# Altium schematic sheet 425AK01A_S09.SchDoc
size A3; DocumentNumber: 9; SheetNumber: 9; SheetTotal: 10; PageSetup: Record=PageOptions|CenterHorizontal=True|CenterVertical=True|PrintScale=1.01|XCorrection=1.00|YCorrection=1.00|PrintKind=1|BorderSize=5000000|LeftOffset=0|BottomOffset=0|Orientation=2|PaperLength=1000|PaperWidth=1000|Scale=100|PaperSource=15|PrintQuality=600|MediaType=1|DitherType=10|PaperKind=A3|PrintScaleMode=1; 00_Drawn: RJG; 00_Date: 8APR2022; 00_Checked: SR; 00_Approved: GN; 00_Line1: Switches and Output Buffers
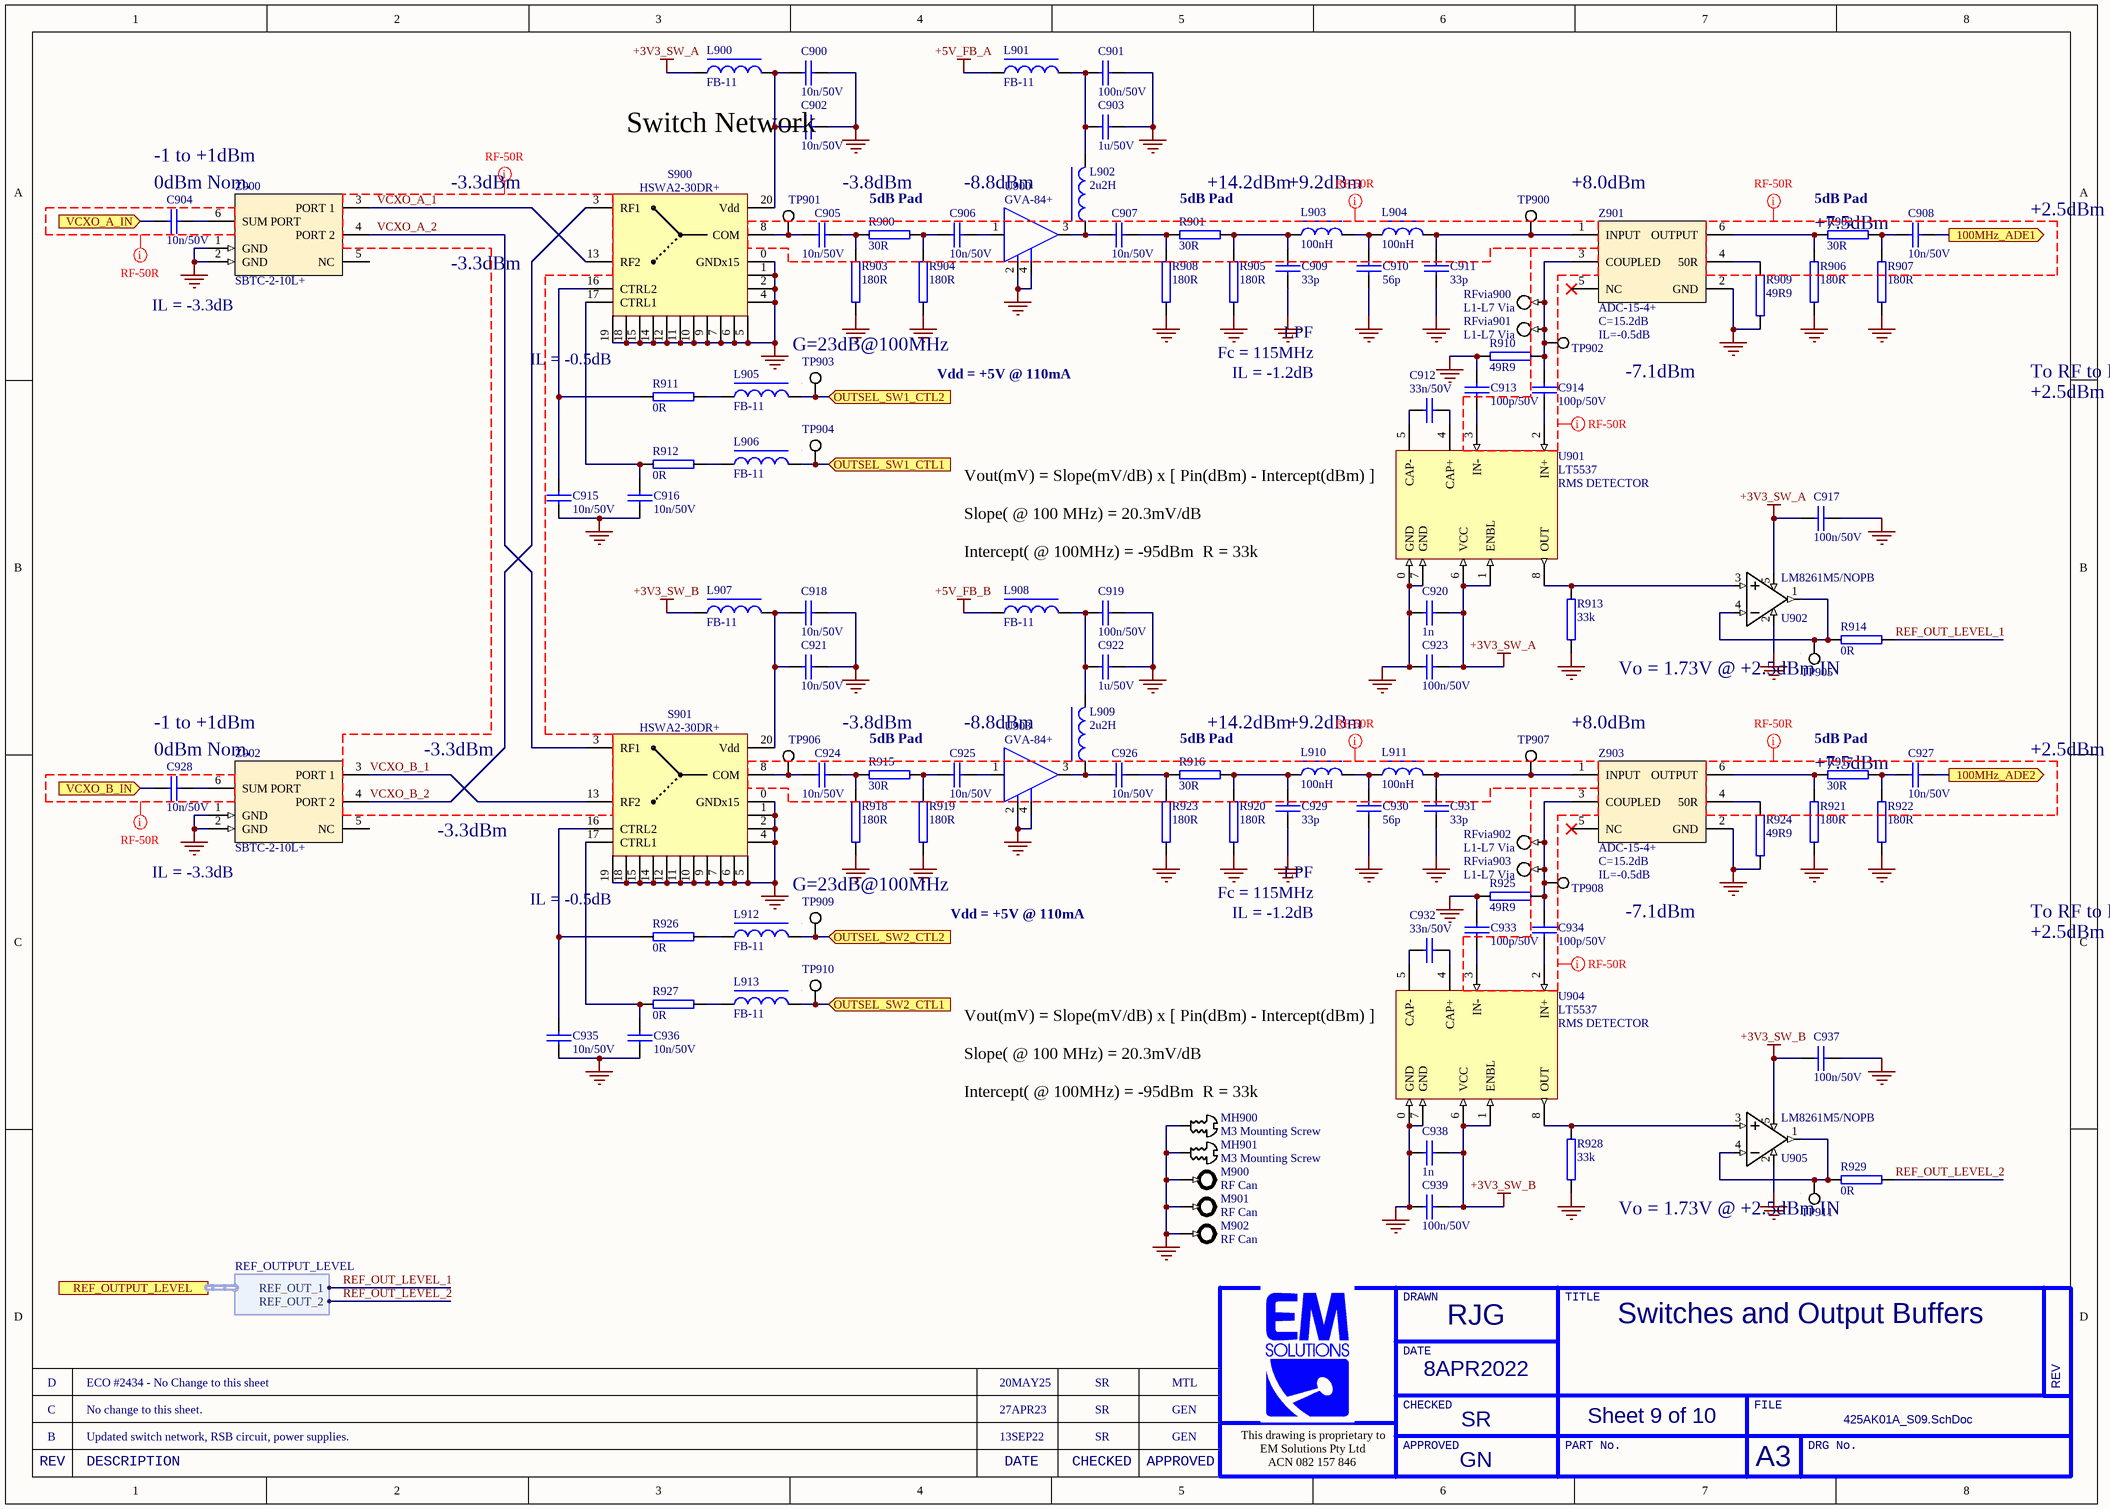
[diagram p0: 425AK01A_S09.SchDoc]

## Parts
C900  10n/50V  [0402C]
C901  100n/50V  [0402C]
C902  10n/50V  [0402C]
C903  1u/50V  [0603C]
C904  10n/50V  [0402C]
C905  10n/50V  [0402C]
C906  10n/50V  [0402C]
C907  10n/50V  [0402C]
C908  10n/50V  [0402C]
C909  33p  [0402C]
C910  56p  [0402C]
C911  33p  [0402C]
C912  33n/50V  [0402C]
C913  100p/50V  [0402C]
C914  100p/50V  [0402C]
C915  10n/50V  [0402C]
C916  10n/50V  [0402C]
C917  100n/50V  [0402C]
C918  10n/50V  [0402C]
C919  100n/50V  [0402C]
C920  1n  [0402C]
C921  10n/50V  [0402C]
C922  1u/50V  [0603C]
C923  100n/50V  [0402C]
C924  10n/50V  [0402C]
C925  10n/50V  [0402C]
C926  10n/50V  [0402C]
C927  10n/50V  [0402C]
C928  10n/50V  [0402C]
C929  33p  [0402C]
C930  56p  [0402C]
C931  33p  [0402C]
C932  33n/50V  [0402C]
C933  100p/50V  [0402C]
C934  100p/50V  [0402C]
C935  10n/50V  [0402C]
C936  10n/50V  [0402C]
C937  100n/50V  [0402C]
C938  1n  [0402C]
C939  100n/50V  [0402C]
L900  FB-11  [0402L]
L901  FB-11  [0402L]
L902  2u2H  [0805L]
L903  100nH  [0402L]
L904  100nH  [0402L]
L905  FB-11  [0402L]
L906  FB-11  [0402L]
L907  FB-11  [0402L]
L908  FB-11  [0402L]
L909  2u2H  [0805L]
L910  100nH  [0402L]
L911  100nH  [0402L]
L912  FB-11  [0402L]
L913  FB-11  [0402L]
M900  RF Can  [Can_38x25.4x6mm]
M901  RF Can  [Can_38x25.4x6mm]
M902  RF Can  [Can_38x25.4x6mm]
MH900  M3 Mounting Screw  [M3_SCREW]  (no BOM)
MH901  M3 Mounting Screw  [M3_SCREW]  (no BOM)
R900  30R  [0402]
R901  30R  [0402]
R902  30R  [0402]
R903  180R  [0402]
R904  180R  [0402]
R905  180R  [0402]
R906  180R  [0402]
R907  180R  [0402]
R908  180R  [0402]
R909  49R9  [0402]
R910  49R9  [0402]
R911  0R  [0402]
R912  0R  [0402]
R913  33k  [0402]
R914  0R  [0402]
R915  30R  [0402]
R916  30R  [0402]
R917  30R  [0402]
R918  180R  [0402]
R919  180R  [0402]
R920  180R  [0402]
R921  180R  [0402]
R922  180R  [0402]
R923  180R  [0402]
R924  49R9  [0402]
R925  49R9  [0402]
R926  0R  [0402]
R927  0R  [0402]
R928  33k  [0402]
R929  0R  [0402]
RFvia900  L1-L7 Via  [RFvia_L1-L7]  (no BOM)
RFvia901  L1-L7 Via  [RFvia_L1-L7]  (no BOM)
RFvia902  L1-L7 Via  [RFvia_L1-L7]  (no BOM)
RFvia903  L1-L7 Via  [RFvia_L1-L7]  (no BOM)
S900  HSWA2-30DR+  [DG983-1]
S901  HSWA2-30DR+  [DG983-1]
TP900  Pad  [Testpoint-0.5mm-SMT-withPaste]  (value not drawn)  (no BOM)
TP901  Pad  [Testpoint-0.5mm-SMT-withPaste]  (value not drawn)  (no BOM)
TP902  Pad  [Testpoint-0.5mm-SMT-withPaste]  (value not drawn)  (no BOM)
TP903  Pad  [Testpoint-0.5mm-SMT-withPaste]  (value not drawn)  (no BOM)
TP904  Pad  [Testpoint-0.5mm-SMT-withPaste]  (value not drawn)  (no BOM)
TP905  Pad  [Testpoint-0.5mm-SMT-withPaste]  (value not drawn)  (no BOM)
TP906  Pad  [Testpoint-0.5mm-SMT-withPaste]  (value not drawn)  (no BOM)
TP907  Pad  [Testpoint-0.5mm-SMT-withPaste]  (value not drawn)  (no BOM)
TP908  Pad  [Testpoint-0.5mm-SMT-withPaste]  (value not drawn)  (no BOM)
TP909  Pad  [Testpoint-0.5mm-SMT-withPaste]  (value not drawn)  (no BOM)
TP910  Pad  [Testpoint-0.5mm-SMT-withPaste]  (value not drawn)  (no BOM)
TP911  Pad  [Testpoint-0.5mm-SMT-withPaste]  (value not drawn)  (no BOM)
U900  GVA-84+  [SOT-89-RF]
U901  LT5537  [DFN-8]
U902  LM8261M5/NOPB  [SOT-23/5]
U903  GVA-84+  [SOT-89-RF]
U904  LT5537  [DFN-8]
U905  LM8261M5/NOPB  [SOT-23/5]
Z900  SBTC-2-10L+  [SBTC-2-10L+]
Z901  ADC-15-4+  [ADC-15-4+]
Z902  SBTC-2-10L+  [SBTC-2-10L+]
Z903  ADC-15-4+  [ADC-15-4+]

## Ports
100MHz_ADE1 (out), 100MHz_ADE2 (out), OUTSEL_SW1_CTL1 (in), OUTSEL_SW1_CTL2 (in), OUTSEL_SW2_CTL1 (in), OUTSEL_SW2_CTL2 (in), REF_OUTPUT_LEVEL (harness REF_OUTPUT_LEVEL), VCXO_A_IN (in), VCXO_B_IN (in)

## Harnesses
REF_OUTPUT_LEVEL: REF_OUT_1, REF_OUT_2

## Nets
+3V3_SW_A: C917.1 C920.2 C923.1 L900.2 U901.1(ENBL) U901.6(VCC) U902.5(V+)
+3V3_SW_B: C937.1 C938.2 C939.1 L907.2 U904.1(ENBL) U904.6(VCC) U905.5(V+)
+5V_FB_A: L901.1
+5V_FB_B: L908.1
GND: C900.1 C901.2 C902.2 C903.1 C909.2 C910.2 C911.1 C913.1 C915.1 C916.1 C917.2 C918.1 C919.2 C920.1 C921.2 C922.1 C923.2 C929.2 C930.2 C931.1 C933.1 C935.1 C936.1 C937.2 C938.1 C939.2 M900.0 M901.0 M902.0 MH900.1 MH901.1 R903.1 R904.1 R905.1 R906.1 R907.1 R908.1 R909.1 R910.1 R913.1 R918.1 R919.1 R920.1 R921.1 R922.1 R923.1 R924.1 R925.1 R928.1 S900.0(GNDx15) S900.1(GND) S900.2(GND) S900.4(GND) S900.5(GND) S900.6(GND) S900.7(GND) S900.9(GND) S900.10(GND) S900.11(GND) S900.12(GND) S900.14(GND) S900.15(GND) S900.18(GND) S900.19(GND) S901.0(GNDx15) S901.1(GND) S901.2(GND) S901.4(GND) S901.5(GND) S901.6(GND) S901.7(GND) S901.9(GND) S901.10(GND) S901.11(GND) S901.12(GND) S901.14(GND) S901.15(GND) S901.18(GND) S901.19(GND) U900.2 U900.4 U901.0(GND) U901.7(GND) U902.2(V-) U903.2 U903.4 U904.0(GND) U904.7(GND) U905.2(V-) Z900.1(GND) Z900.2(GND) Z901.2(GND) Z902.1(GND) Z902.2(GND) Z903.2(GND)
100MHz_ADE1: C908.2 ; port 100MHz_ADE1
100MHz_ADE2: C927.2 ; port 100MHz_ADE2
OUTSEL_SW1_CTL1: L906.1 TP904.1 ; port OUTSEL_SW1_CTL1
OUTSEL_SW1_CTL2: L905.1 TP903.1 ; port OUTSEL_SW1_CTL2
OUTSEL_SW2_CTL1: L913.1 TP910.1 ; port OUTSEL_SW2_CTL1
OUTSEL_SW2_CTL2: L912.1 TP909.1 ; port OUTSEL_SW2_CTL2
REF_OUT_LEVEL_1: R914.2 ; port REF_OUTPUT_LEVEL.REF_OUT_1
REF_OUT_LEVEL_2: R929.2 ; port REF_OUTPUT_LEVEL.REF_OUT_2
VCXO_A_1: S900.13(RF2) Z900.3(PORT_1)
VCXO_A_2: S901.3(RF1) Z900.4(PORT_2)
VCXO_A_IN: C904.1 ; port VCXO_A_IN
VCXO_B_1: S901.13(RF2) Z902.3(PORT_1)
VCXO_B_2: S900.3(RF1) Z902.4(PORT_2)
VCXO_B_IN: C928.1 ; port VCXO_B_IN
NetC900_2: C900.2 C902.1 L900.1 S900.20(Vdd)
NetC901_1: C901.1 C903.2 L901.2 L902.2
NetC904_2: C904.2 Z900.6(SUM_PORT)
NetC905_1: C905.1 S900.8(COM) TP901.1
NetC905_2: C905.2 R900.2 R903.2
NetC906_1: C906.1 R900.1 R904.2
NetC906_2: C906.2 U900.1
NetC907_1: C907.1 L902.1 U900.3
NetC907_2: C907.2 R901.2 R908.2
NetC908_1: C908.1 R902.1 R907.2
NetC909_1: C909.1 L903.1 R901.1 R905.2
NetC910_1: C910.1 L903.2 L904.1
NetC911_2: C911.2 L904.2 TP900.1 Z901.1(INPUT)
NetC912_1: C912.1 U901.5(CAP-)
NetC912_2: C912.2 U901.4(CAP+)
NetC913_2: C913.2 U901.3(IN-)
NetC914_1: C914.1 R910.2 RFvia900.1 RFvia901.1 TP902.1 Z901.3(COUPLED)
NetC914_2: C914.2 U901.2(IN+)
NetC915_2: C915.2 R911.2 S900.16(CTRL2)
NetC916_2: C916.2 R912.2 S900.17(CTRL1)
NetC918_2: C918.2 C921.1 L907.1 S901.20(Vdd)
NetC919_1: C919.1 C922.2 L908.2 L909.2
NetC924_1: C924.1 S901.8(COM) TP906.1
NetC924_2: C924.2 R915.2 R918.2
NetC925_1: C925.1 R915.1 R919.2
NetC925_2: C925.2 U903.1
NetC926_1: C926.1 L909.1 U903.3
NetC926_2: C926.2 R916.2 R923.2
NetC927_1: C927.1 R917.1 R922.2
NetC928_2: C928.2 Z902.6(SUM_PORT)
NetC929_1: C929.1 L910.1 R916.1 R920.2
NetC930_1: C930.1 L910.2 L911.1
NetC931_2: C931.2 L911.2 TP907.1 Z903.1(INPUT)
NetC932_1: C932.1 U904.5(CAP-)
NetC932_2: C932.2 U904.4(CAP+)
NetC933_2: C933.2 U904.3(IN-)
NetC934_1: C934.1 R925.2 RFvia902.1 RFvia903.1 TP908.1 Z903.3(COUPLED)
NetC934_2: C934.2 U904.2(IN+)
NetC935_2: C935.2 R926.2 S901.16(CTRL2)
NetC936_2: C936.2 R927.2 S901.17(CTRL1)
NetL905_2: L905.2 R911.1
NetL906_2: L906.2 R912.1
NetL912_2: L912.2 R926.1
NetL913_2: L913.2 R927.1
NetR902_2: R902.2 R906.2 Z901.6(OUTPUT)
NetR909_2: R909.2 Z901.4(50R)
NetR913_2: R913.2 U901.8(OUT) U902.3(IN+)
NetR914_1: R914.1 TP905.1 U902.1(OUT) U902.4(IN-)
NetR917_2: R917.2 R921.2 Z903.6(OUTPUT)
NetR924_2: R924.2 Z903.4(50R)
NetR928_2: R928.2 U904.8(OUT) U905.3(IN+)
NetR929_1: R929.1 TP911.1 U905.1(OUT) U905.4(IN-)

Not connected (* = marked no-connect by the designer): Z900 5(NC); Z901 5(NC)*; Z902 5(NC); Z903 5(NC)*

## Layout directives
net class RF-50R: (no net found under the mark), VCXO_A_1, VCXO_A_2, VCXO_B_1, VCXO_B_2

## Notes on the sheet
- -1 to +1dBm
- Switch Network
- (near C904) 0dBm Nom.
- (near Z900) -3.3dBm
- -3.8dBm
- 5dB Pad
- -8.8dBm
- (near R901) 5dB Pad
- +14.2dBm
- +9.2dBm
- (near TP900) +8.0dBm
- (near R902) 5dB Pad
- (near R902) +7.5dBm
- (near C908) +2.5dBm
- (near Z900) IL = -3.3dB
- IL = -0.5dB
- Vdd = +5V @ 110mA
- (near R904) G=23dB@100MHz
- LPF
- Fc = 115MHz
- (near C912) IL = -1.2dB
- C=15.2dB
- IL=-0.5dB
- -7.1dBm
- To RF to Fibre Converter to ADE 1
- +2.5dBm Nom.
- (near U901) RMS DETECTOR
- (near U901) Vout(mV) = Slope(mV/dB) x [ Pin(dBm) - Intercept(dBm) ]
  Slope( @ 100 MHz) = 20.3mV/dB
  Intercept( @ 100MHz) = -95dBm  R = 33k
- Vo = 1.73V @ +2.5dBm IN
- (near C928) 0dBm Nom.
- (near Z902) -3.3dBm
- (near R916) 5dB Pad
- (near TP907) +8.0dBm
- (near R917) 5dB Pad
- (near R917) +7.5dBm
- (near C927) +2.5dBm
- (near Z902) IL = -3.3dB
- (near R919) G=23dB@100MHz
- (near C932) IL = -1.2dB
- To RF to Fibre Converter to ADE 2
- (near U904) RMS DETECTOR
- Vout(mV) = Slope(mV/dB) x [ Pin(dBm) - Intercept(dBm) ]
  Slope( @ 100 MHz) = 20.3mV/dB
  Intercept( @ 100MHz) = -95dBm  R = 33k
- D
- ECO #2434 - No Change to this sheet
- 20MAY25
- SR
- MTL
- B
- C
- Updated switch network, RSB circuit, power supplies.
- No change to this sheet.
- 13SEP22
- 27APR23
- GEN
- DRAWN
- TITLE
- DATE
- REV
- This drawing is proprietary to
- EM Solutions Pty Ltd
- APPROVED
- CHECKED
- PART No.
- FILE
- A3
- DRG No.
- DESCRIPTION
- ACN 082 157 846

## Library data of the parts
C900 C918 = 41-010N-12: Capacitor, 0402, 10n X7R 10% 50V Ceramic, NiSn; MANUFACTURER: MURATA; ID: 2217; MODELNAME: GCM155R71H103KA55D; Part Number: 41-010N-12; ItemID: 41-010N-12
C901 C919 = 41-100N-13: Capacitor, 0402, 100n, X7R, 10% 50V, Ceramic; MANUFACTURER: MURATA; MODELNAME: GRM155R71H104KE14J; ID: 2441; Part Number: 41-100N-13; ItemID: 41-100N-13
C902 C904-C908 C915 C916 C921 C924-C928 C935 C936 = 41-010N-12: Capacitor, 0402, 10n X7R 10% 50V Ceramic, NiSn; MANUFACTURER: MURATA; MODELNAME: GCM155R71H103KA55D; ID: 2217; Part Number: 41-010N-12; ItemID: 41-010N-12
C903 C922 = 41-01U0-06: Capacitor, 0603, 1u X7R 10% 50V Ceramic, NiSn; MANUFACTURER: TAIYOYUDEN; ID: 2287; MODELNAME: UMK107AB7105KA; Part Number: 41-01U0-06; ItemID: 41-01U0-06
C909 C911 C929 C931 = 41-033P-10: Capacitor, 0402, 33p NPO 2% 50V HiQ, NiSn; MANUFACTURER: MURATA; ID: 2339; MODELNAME: GJM1555C1H330GB01D; Part Number: 41-033P-10; ItemID: 41-033P-10
C910 C930 = 41-056P-05: Capacitor, 0402, 56p NPO 5% 50V Ceramic, NiSn; MANUFACTURER: YAGEO; ID: 2398; MODELNAME: CC0402JRNP09BN560; Part Number: 41-056P-05; ItemID: 41-056P-05
C912 C932 = 41-033N-01: *Capacitor, 0402, 33n, X7R, 10%, 50V; Part Number: 41-033N-01
C913 C914 C933 C934 = 41-100P-11: Capacitor, 0402, 100p NPO 5% 50V Ceramic, AEC-Q200; MANUFACTURER: TDK; MODELNAME: CGA2B2C0G1H101J050BA; ID: 2448; Part Number: 41-100P-11; ItemID: 41-100P-11
C917 C923 C937 C939 = 41-100N-13: Capacitor, 0402, 100n, X7R, 10% 50V, Ceramic; MANUFACTURER: MURATA; ID: 2441; MODELNAME: GRM155R71H104KE14J; Part Number: 41-100N-13; ItemID: 41-100N-13
C920 C938 = 1n_50V_0402: Capacitor, 0402, 1n X7R 10% 50V Ceramic, NiSn; Part Number: 41-01N0-05
L900 L901 L905-L908 L912 L913 = 46-B-11: Solid Inductor, 600ohm@100MHz, DCR=0.52, 0.3A, 0402 size; MANUFACTURER: TDK; ID: 3256; MODELNAME: MMZ1608B301CTAH0; Part Number: 46-B-11; ItemID: 46-B-11
L902 L909 = 46-02U2-01: Inductor, Chip, 2u2H 10%, 0805, SIMID08B Series; MANUFACTURER: SIEMENS; MODELNAME: B82498-B3222-K; Part Number: 46-02U2-01; Category: EMS Parts Master
L903 L904 L910 L911 = 46-100N-03: Inductor, Chip, 100nH, 0402; Part Number: 46-100N-03
M900-M902 = Can-RF: Part Number: 11-0256
MH900 MH901 = M3 Screw
R900-R902 R915-R917 = 44-030R-04: Resistor, 30R, 0402, 1%, 100mW; Part Number: 44-030R-04
R903-R908 R918-R923 = 44-180R-10: Resistor, 0402, 180R 1% 0.063W; MANUFACTURER: GENERIC; ID: 2981; Part Number: 44-180R-10; MODELNAME: GENERIC; ItemID: 44-180R-10
R909 R910 R924 R925 = 44-049R9-10: Resistor, 0402, 49R9 1% 0.063W; MODELNAME: RC0402FR-0749R9L; ID: 2787; Part Number: 44-049R9-10; ItemID: 44-049R9-10
R911 R912 R926 R927 = 44-000R-10: Resistor, 0402, 0R 1% 0.063W; MANUFACTURER: GENERIC; ID: 2538; Part Number: 44-000R-10; ItemID: 44-000R-10; MODELNAME: GENERIC
R913 R928 = 44-033K-10: Resistor, 0402, 33k 1% 0.063W; MANUFACTURER: GENERIC; ID: 2720; Part Number: 44-033K-10; ItemID: 44-033K-10; MODELNAME: GENERIC
R914 R929 = 44-000R-10: Resistor, 0402, 0R 1% 0.063W; Part Number: 44-000R-10
RFvia900-RFvia903 = RFvia_L1-L7: RF Via from layer 1 to layer 7, on an 8-layer board.; Rule: UNIONINDEX=0|RULEKIND=PlaneClearance|NETSCOPE=AnyNet|LAYERKIND=SameLayer|NAME=Schematic Power Plane Clearance|CLEARANCE=13.7795mil|UNIT=Imperial
S900 S901 = HSWA2-30DR+: RF Switch, SPDT, DC-3GHz, Absorptive, IL=1dB, I=60dB, P=30dBm, 2V7-3V3, 4x4 QFN; MANUFACTURER: MINICCTS; ID: 3484; Part Number: 54-30-01; MODELNAME: HSWA2-30DR+; ItemID: 54-30-01
TP900-TP911 = Pad: Pad that can be a test point or a hot via
U900 U903 = GVA-84+: MMIC, DC-7GHz, G=24dB, P1dB=20.5dBm, SOT-89; Part Number: 58-GVA84-01
U901 U904 = LT5537EDDB: RF Detector, 10-1000MHz, 83dB, -40/+85C, 8-DFN 3x2mm; Part Number: 54-5537-01; MPN: LT5537EDDB
U902 U905 = OpAmp-LM8261: Opamp, RRIO, 2V5 to 30V supply, 21MHz GBWP; Part Number: 52-8621-01
Z900 Z902 = 33-0055: Divider/Combiner, 2 Way, 0 deg, 10 -1000MHz, Tx Line Tranformer; MANUFACTURER: MINICCTS; ID: 2075; Part Number: 33-0055; ItemID: 33-0055; MODELNAME: SBTC-2-10L+
Z901 Z903 = 33-0058: Directional Coupler, C=15.5dB, 5-1000MHz, SM; MANUFACTURER: MINICCTS; ID: 2077; Part Number: 33-0058; MODELNAME: ADC-15-4+; ItemID: 33-0058